# EAGLE design pcb (EAGLE 8.3.2)
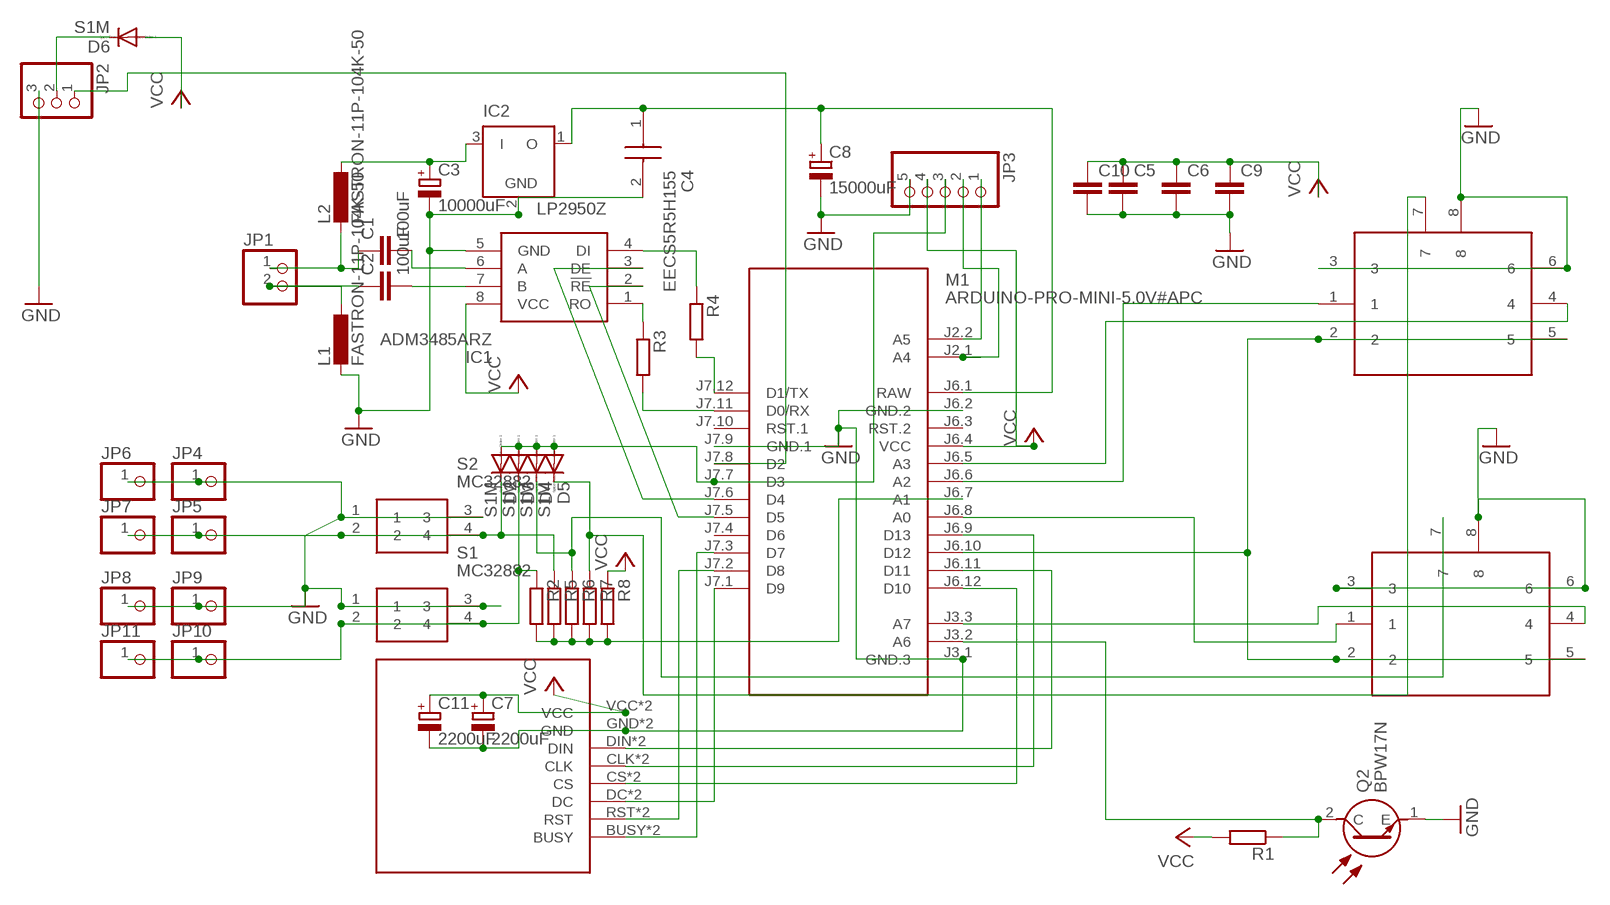
[diagram p0: schematic, sheet 1]

## Parts
C1  100uF  C-EUC1210  [C1210]
C2  100uF  C-EUC1210  [C1210]
C3  10000uF  CPOL-EUE7.5-18  [E7,5-18]
C4  EECS5R5H155  [SG(H)]
C5  C-EUC1812  [C1812]
C6  C-EUC1812  [C1812]
C7  2200uF  CPOL-EUTT5D9  [TT5D9]
C8  15000uF  CPOL-EUE7.5-18  [E7,5-18]
C9  C-EUC1812  [C1812]
C10  C-EUC1812  [C1812]
C11  2200uF  CPOL-EUTT5D9  [TT5D9]
D2  S1M  [SMA]
D3  S1M  [SMA]
D4  S1M  [SMA]
D5  S1M  [SMA]
D6  S1M  [SMA]
IC1  ADM3485ARZ  [SOIC127P600X175-8N]
IC2  LP2950Z  [TO92]
JP1  PINHD-1X2  [1X02]
JP2  PINHD-1X3  [1X03]
JP3  PINHD-1X55X2MM  [1_05X2MM]
JP4  PINHD-1X1  [1X01]
JP5  PINHD-1X1  [1X01]
JP6  PINHD-1X1  [1X01]
JP7  PINHD-1X1  [1X01]
JP8  PINHD-1X1  [1X01]
JP9  PINHD-1X1  [1X01]
JP10  PINHD-1X1  [1X01]
JP11  PINHD-1X1  [1X01]
L1  FASTRON-11P-104K-50  [E5-10,5]
L2  FASTRON-11P-104K-50  [E5-10,5]
M1  ARDUINO-PRO-MINI-5.0V#APC  [ARDUINO-PRO-MINI#APC]
Q2  BPW17N  [BPW17N]
R1  R-EU_R1206  [R1206]
R2  R-EU_R1206  [R1206]
R3  R-EU_R1206  [R1206]
R4  R-EU_R1206  [R1206]
R5  R-EU_R1206  [R1206]
R6  R-EU_R1206  [R1206]
R7  R-EU_R1206  [R1206]
R8  R-EU_R1206  [R1206]
S1  MC32882  [MC32882]
S2  MC32882  [MC32882]
U$1  FJ08K-S  [FJ08K-S]
U$2  FJ08K-S  [FJ08K-S]
U$3  1,54-E-PAPER  [1,54-E-PAPER]

## Nets
A [power]: C1.2 IC1.6(A)
A1 [power]: C1.1 JP1.1 L2.-
B [power]: C2.2 IC1.7(B)
B1 [power]: C2.1 JP1.2 L1.+
GND [power]: C3.- C4.2 C5.2 C6.2 C7.- C8.- C9.2 C10.2 C11.- IC1.5(GND) IC2.2(GND) JP2.3 JP3.5 JP4.1 JP6.1 JP8.1 JP9.1 L1.- M1.J3.1(GND.3) M1.J6.2(GND.2) M1.J7.9(GND.1) Q2.1(E) S1.1 S1.3 S2.1 S2.3 U$1.3 U$1.6 U$1.8 U$2.3 U$2.6 U$2.8 U$3.GND U$3.GND1(GND)
N$1: M1.J6.8(A0) U$2.1
N$2: D2.C JP5.1 JP7.1 R5.1 S2.2 S2.4
N$3: JP3.1 M1.J2.2(A5)
N$4: M1.J7.3(D7) U$3.BUSY U$3.BUSY1(BUSY)
N$5: M1.J7.2(D8) U$3.RST U$3.RST1(RST)
N$6: M1.J7.1(D9) U$3.DC U$3.DC1(DC)
N$7: M1.J6.12(D10) U$3.CS U$3.CS1(CS)
N$8: M1.J6.9(D13) U$3.CLK U$3.CLK1(CLK)
N$9: M1.J6.11(D11) U$3.DIN U$3.DIN1(DIN)
N$11: M1.J6.10(D12) U$1.2 U$1.5 U$2.2 U$2.5
N$12: M1.J3.3(A7) U$2.4
N$13: D5.C R7.1 U$1.7
N$14: M1.J6.6(A2) U$1.1
N$15: M1.J6.5(A3) U$1.4
N$16: D4.C R6.1 U$2.7
N$17: M1.J3.2(A6) Q2.2(C) R1.1
N$19: M1.J7.11(D0/RX) R3.2
N$20 [power]: C3.+ IC2.3(I) L2.+
N$21: IC1.3(DE) M1.J7.6(D4)
N$22: IC1.4(DI) R4.1
N$23: M1.J7.12(D1/TX) R4.2
N$24 [power]: D6.C JP2.2
N$25: IC1.1(RO) R3.1
N$27: JP2.1 M1.J7.8(D2)
N$28: IC1.2(!RE) M1.J7.5(D5)
N$29: M1.J6.7(A1) R2.2 R5.2 R6.2 R7.2 R8.2
N$30: D2.A D3.A D4.A D5.A JP3.3 M1.J7.7(D3)
N$32: JP3.2 M1.J2.1(A4)
N$33: D3.C JP10.1 JP11.1 R2.1 S1.2 S1.4
RAW [power]: C4.1 C8.+ IC2.1(O) M1.J6.1(RAW)
VCC [power]: C5.1 C6.1 C7.+ C9.1 C10.1 C11.+ D6.A IC1.8(VCC) JP3.4 M1.J6.4(VCC) R1.2 R8.1 U$3.VCC U$3.VCC1(VCC)
Unconnected: M1.J6.3(RST.2) M1.J7.4(D6) M1.J7.10(RST.1)

## Library data of the parts
C1 C2 C5 C6 C9 C10 = rcl:C-EU: CAPACITOR, European symbol
C3 C7 C8 C11 = resistor:CPOL-EU: POLARIZED CAPACITOR, European symbol
C4 = SamacSys_Parts1:EECS5R5H155: Panasonic 1.5F 5.5 V dc Through Hole Electric Double Layer Capacitor Source: Datasheet <http://uk.rs-online.com/web/p/products/1094092>; ALLIED_NUMBER: 70067995; ALLIED_PRICE-STOCK: https://www.alliedelec.com/panasonic-eecs5r5h155/70067995/; DESCRIPTION: Panasonic 1.5F 5.5 V dc Through Hole Electric Double Layer Capacitor; HEIGHT: mm; MANUFACTURER_NAME: Panasonic; MANUFACTURER_PART_NUMBER: EECS5R5H155; RS_PART_NUMBER: 9190657; RS_PRICE-STOCK: https://uk.rs-online.com/web/p/products/9190657
D2-D6 = diode:S1M
IC1 = SamacSys_Parts1:ADM3485ARZ: ADM3485ARZ, Line Transceiver, EIA-485, EIA-422, RS-485, RS-422 10Mbit/s Differential, 3.3V, 8-Pin SOIC Source: Datasheet <http://docs-emea.rs-online.com/webdocs/0de0/0900766b80de0e4e.pdf>; DESCRIPTION: ADM3485ARZ, Line Transceiver, EIA-485, EIA-422, RS-485, RS-422 10Mbit/s Differential, 3.3V, 8-Pin SOIC; HEIGHT: 1.75mm; MANUFACTURER_NAME: Analog Devices; MANUFACTURER_PART_NUMBER: ADM3485ARZ; MOUSER_PART_NUMBER: 584-ADM3485ARZ; MOUSER_PRICE-STOCK: https://www.mouser.com/Search/Refine.aspx?Keyword=584-ADM3485ARZ; RS_PART_NUMBER: 6977653P; RS_PRICE-STOCK: http://uk.rs-online.com/web/p/products/6977653P
IC2 = linear:LP2950: 100 mA, Low Power Low Dropout Voltage Regulator Source: http://www.onsemi.com/pub/Collateral/LP2950-D.PDF
JP1 = pinhead:PINHD-1X2: PIN HEADER
JP2 = pinhead:PINHD-1X3: PIN HEADER
JP3 = pinhead:PINHD-1X5: PIN HEADER
JP4-JP11 = pinhead:PINHD-1X1: PIN HEADER
L1 L2 = eigene:FASTRON-11P-104K-50
M1 = diy-modules:ARDUINO-PRO-MINI-*#APC: Arduino Pro Mini (and compatible devices) with angle programming connector More details available here: https://www.arduino.cc/en/Main/ArduinoBoardProMini Click here to find device on ebay.com <http://www.ebay.com/sch/arduino+pro+mini>
Q2 = SamacSys_Parts:BPW17N: BPW17N Vishay, 24 IR + Visible Light Phototransistor, Through Hole 2-Pin 1.8/2.4mm package Source: Datasheet <https://www.vishay.com/docs/81516/bpw17n.pdf>; ARROW_PART_NUMBER: BPW17N; ARROW_PRICE-STOCK: https://www.arrow.com/en/products/bpw17n/vishay?region=nac; DESCRIPTION: BPW17N Vishay, 24 IR + Visible Light Phototransistor, Through Hole 2-Pin 1.8/2.4mm package; HEIGHT: 3.7mm; MANUFACTURER_NAME: Vishay; MANUFACTURER_PART_NUMBER: BPW17N; MOUSER_PART_NUMBER: 782-BPW17N; MOUSER_PRICE-STOCK: https://www.mouser.co.uk/ProductDetail/Vishay-Semiconductors/BPW17N?qs=%2Fjqivxn91ceSHvFjVSmzCw%3D%3D
R1-R8 = resistor:R-EU_: RESISTOR, European symbol
S1 S2 = SamacSys_Parts:MC32882: SWITCH, TACTILE, 50MA, 12VDC, SMD Source: Datasheet <http://www.newark.com/pdfs/datasheets/spc/Ta-1143.pdf>; DESCRIPTION: SWITCH, TACTILE, 50MA, 12VDC, SMD; HEIGHT: mm; MANUFACTURER_NAME: MULTICOMP; MANUFACTURER_PART_NUMBER: MC32882
U$1 U$2 = fj:FJ08K-S
U$3 = 1,54-e-paper:1,54-E-PAPER: e-Paper Display 1,54 mit Kabel

## Net classes
1 power: width 0.61 mm, clearance 0.61 mm to class 0

## Board
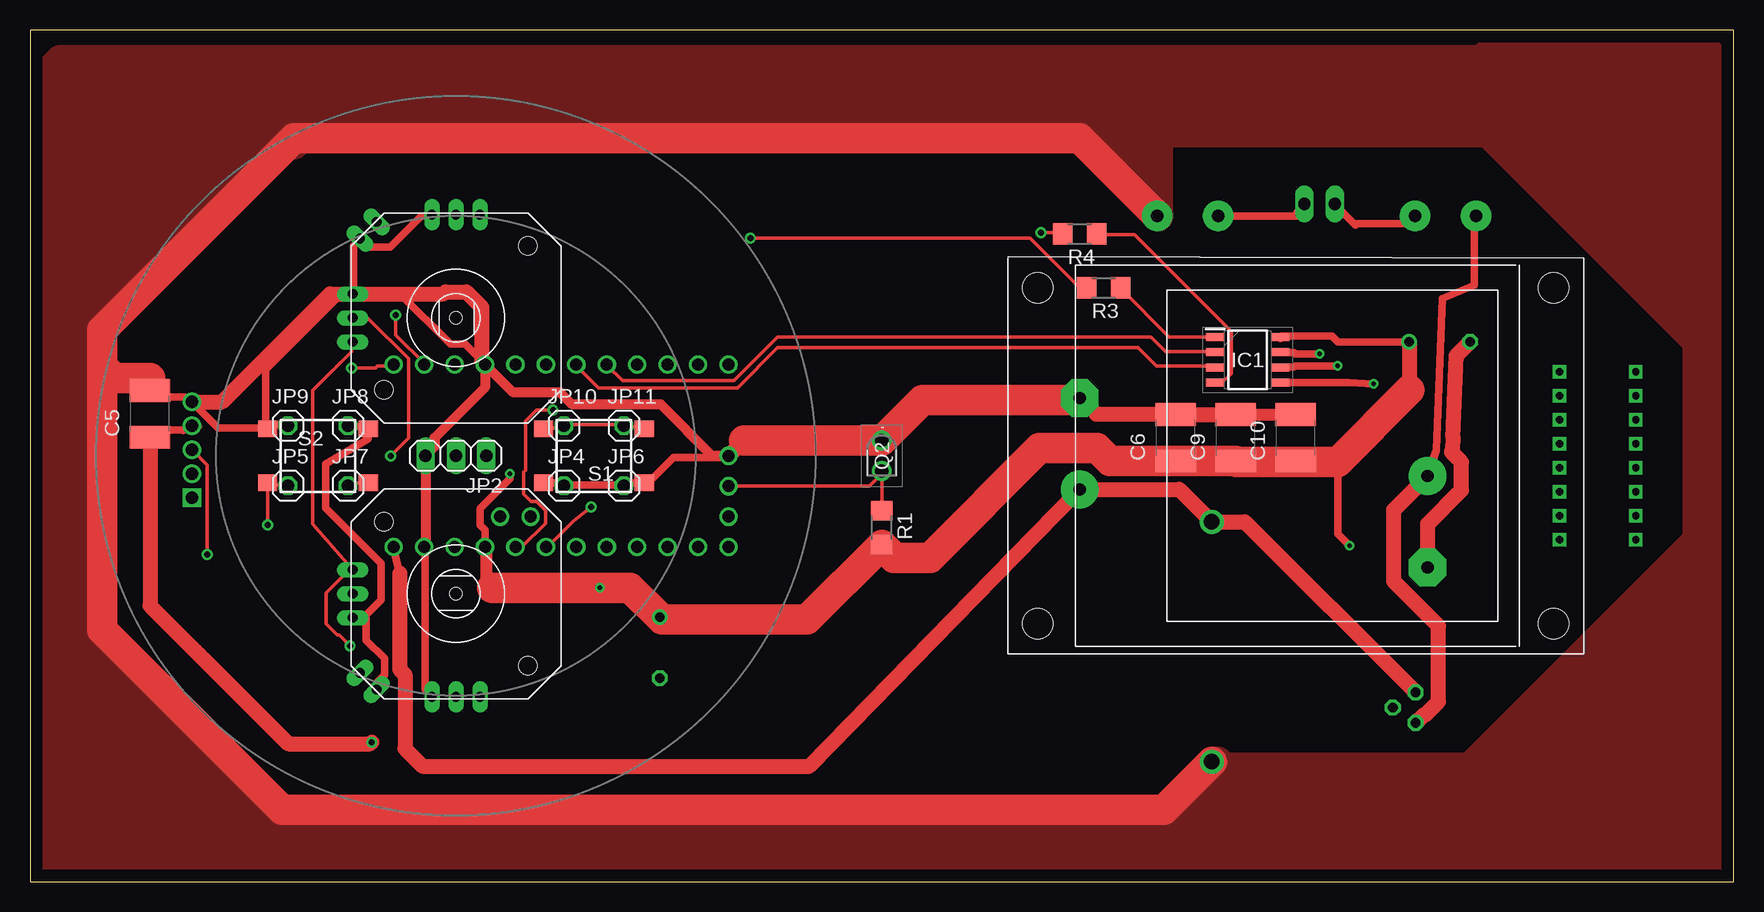
[diagram p1: board, top side]
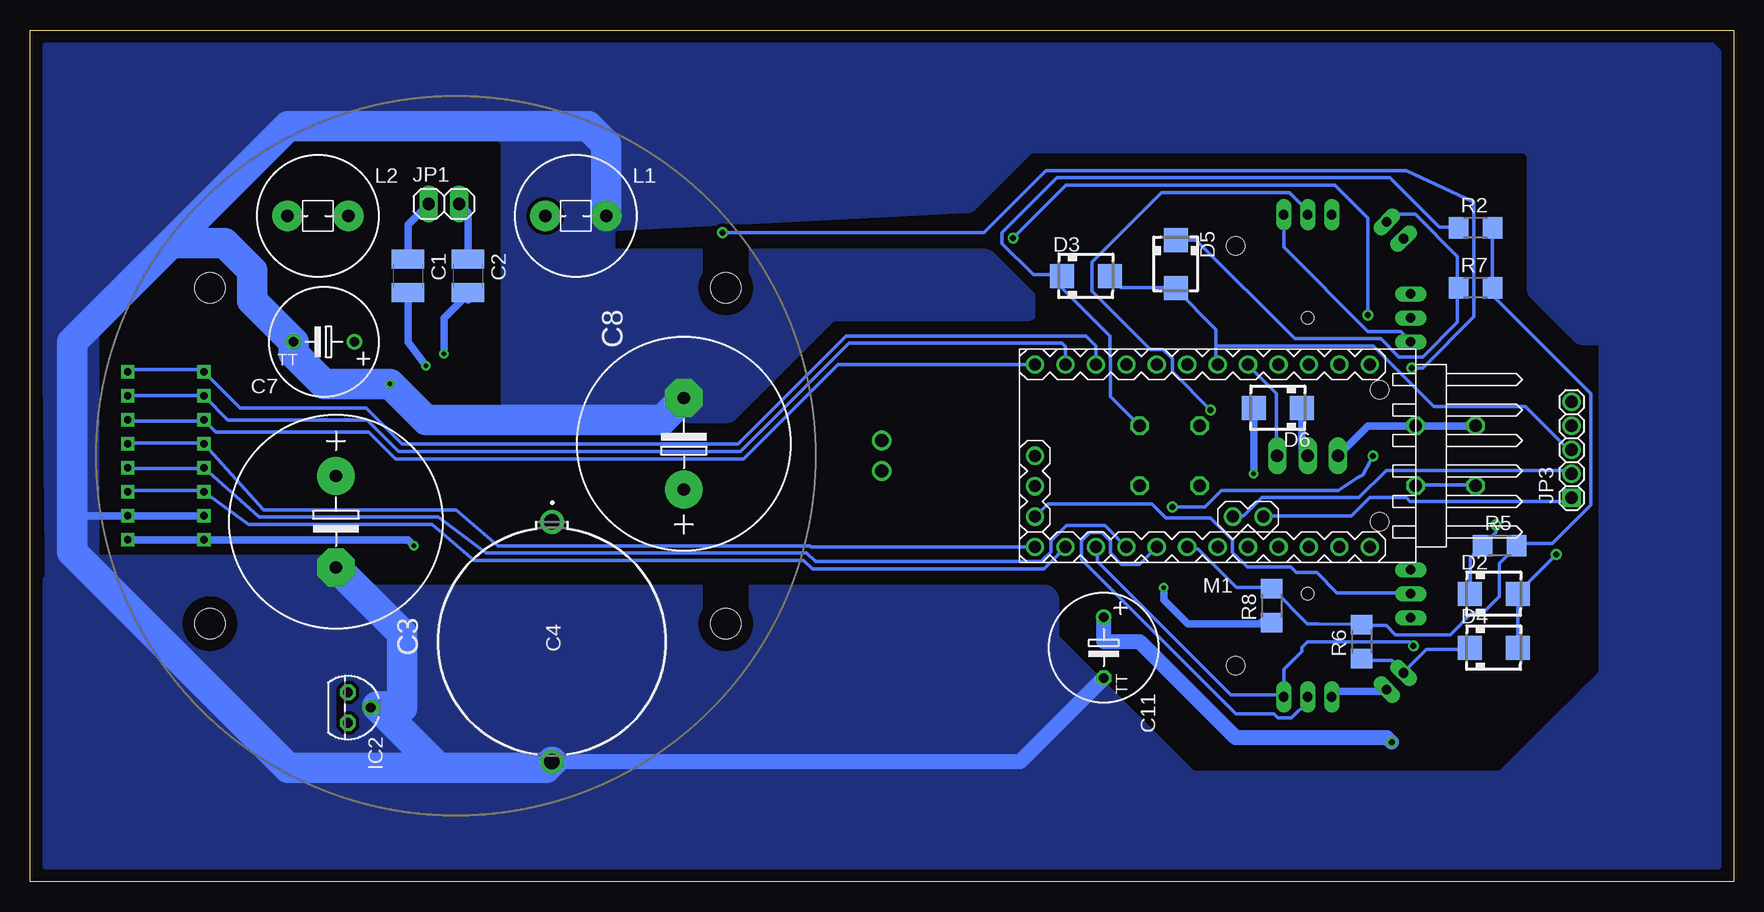
[diagram p2: board, bottom side, seen from below]

Size 142 x 71 mm. Coordinates in mm from the lower left corner, seen from the top.
Outline: 0,0 142,0 142,71 0,71 0,0
Copper layers (1*16): Top 0.035mm / dielectric 1.5mm / Bottom 0.035mm
Design rules "default *": minimum track width 12mil, minimum drill 0.5mm, track to track 12mil, track to pad 12mil, pad to pad 12mil, via to via 12mil, smd to smd 12mil, copper to edge 40mil, drill to drill 6mil, minimum pad ring 10mil, minimum via ring 8mil, stop-mask expansion 4mil, vias tented up to drill 0mil, thermal gap 10mil
Holes 1 mm at 35.5,47 35.5,24

### Footprints (pad centres in the part's own frame; a part is rotated, then mirrored left to right if it is on the bottom)
C1210 = smd 1.6 x 2.7: 1 -1.4,0; 2 1.4,0
E7,5-18 = drill 1.016 pad 3.15: + -3.81,0 | drill 1.016 pad 3.15 octagon: - 3.81,0
SG(H) = drill 1.33 pad 2: 1 -10,0; 2 10,0
C1812 = smd 1.9 x 3.4: 1 -1.95,0; 2 1.95,0
TT5D9 = drill 0.813: + -2.54,0 | drill 0.813 octagon: - 2.54,0
SMA = smd 2 x 2: A 2,0; C -2,0
SOIC127P600X175-8N = smd 1.525 x 0.65: 1 -2.712,1.905; 2 -2.712,0.635; 3 -2.712,-0.635; 4 -2.712,-1.905; 5 2.712,-1.905; 6 2.712,-0.635; 7 2.712,0.635; 8 2.712,1.905
TO92 = drill 0.813 octagon: 1 -1.27,0; 2 0,1.905; 3 1.27,0
1X02 = drill 1.016 long: 1 -1.27,0; 2 1.27,0
1X03 = drill 1.016 long: 1 -2.54,0; 2 0,0; 3 2.54,0
1_05X2MM = drill 1.016 pad 1.3 square: 1 -4,0 | drill 1.016 pad 1.3: 2 -2,0; 3 0,0; 4 2,0; 5 4,0
1X01 = drill 1.016 octagon: 1 0,0
E5-10,5 = drill 1.016 pad 2.54: + -2.54,0; - 2.54,0
ARDUINO-PRO-MINI#APC = drill 1: J2.1 -1.27,5.08; J2.2 -3.81,5.08; J3.1 15.24,0; J3.2 15.24,2.54; J3.3 15.24,5.08; J6.1 -12.7,7.62; J6.2 -10.16,7.62; J6.3 -7.62,7.62; J6.4 -5.08,7.62; J6.5 -2.54,7.62; J6.6 0,7.62; J6.7 2.54,7.62; J6.8 5.08,7.62; J6.9 7.62,7.62; J6.10 10.16,7.62; J6.11 12.7,7.62; J6.12 15.24,7.62; J7.1 15.24,-7.62; J7.2 12.7,-7.62; J7.3 10.16,-7.62; J7.4 7.62,-7.62; J7.5 5.08,-7.62; J7.6 2.54,-7.62; J7.7 0,-7.62; J7.8 -2.54,-7.62; J7.9 -5.08,-7.62; J7.10 -7.62,-7.62; J7.11 -10.16,-7.62; J7.12 -12.7,-7.62
BPW17N = drill 1.09 pad 1.635: 1 -1.27,0; 2 1.27,0
R1206 = smd 1.6 x 1.803: 1 -1.422,0; 2 1.422,0
MC32882 = smd 1.6 x 1.4: 1 -4.2,2.25; 2 -4.2,-2.25; 3 4.2,2.25; 4 4.2,-2.25
FJ08K-S = drill 0.8 long: 1 0,8.6; 2 -2,8.6; 3 2,8.6; 4 8.6,0; 5 8.6,-2; 6 8.6,2; 7 8,6.6; 8 6.6,8 | hole 1.5: -6,6; 6,-6
1,54-E-PAPER = drill 0.6 square: BUSY 22,7; BUSY1 28.35,7; CLK 22,-1; CLK1 28.35,-1; CS 22,1; CS1 28.35,1; DC 22,3; DC1 28.35,3; DIN 22,-3; DIN1 28.35,-3; GND 22,-5; GND1 28.35,-5; RST 22,5; RST1 28.35,5; VCC 22,-7; VCC1 28.35,-7 | hole 2.5: -21.5,-14; -21.5,14; 21.5,14; 21.5,-14

### Placement (x,y rotation side)
C1  110.5,50.5 270 bottom
C2  105.5,50.5 270 bottom
C3  116.5,30 270 bottom
C4  98.5,20 270 bottom
C5  10,39 90 top
C6  95.5,37 90 top
C7  117.5,45 180 bottom
C8  87.5,36.5 90 bottom
C9  100.5,37 90 top
C10  105.5,37 90 top
C11  52.5,19.5 270 bottom
D2  20,24 0 bottom
D3  54,50.5 0 bottom
D4  20,19.5 0 bottom
D5  46.5,51.5 270 bottom
D6  38,39.5 180 bottom
IC1  101.5,43.5 0 top
IC2  115.5,14.5 270 bottom
JP1  107.5,56.5 0 bottom
JP2  35.5,35.5 180 top
JP3  13.5,36 90 bottom
JP4  44.5,33 0 top
JP5  21.5,33 0 top
JP6  49.5,33 0 top
JP7  26.5,33 0 top
JP8  26.5,38 0 top
JP9  21.5,38 0 top
JP10  44.5,38 0 top
JP11  49.5,38 0 top
L1  96.5,55.5 0 bottom
L2  118,55.5 0 bottom
M1  43,35.5 180 bottom
Q2  71,35.5 270 top
R1  71,29.5 270 top
R2  21.5,54.5 0 bottom
R3  89.5,49.5 180 top
R4  87.5,54 180 top
R5  19.5,28 0 bottom
R6  31,20 90 bottom
R7  21.5,49.5 0 bottom
R8  38.5,23 90 bottom
S1  47,35.5 180 top
S2  24,35.5 0 top
U$1  35.5,47 90 top
U$2  35.5,24 180 top
U$3  105.5,35.49 0 top

### Tracks (layer width: path | path; a pad name or v marks a point on that pad's centre or on a via)
A  (via drill 0.35)
  Top 0.305: IC1.6 104.24,42.98
  Top 0.61: v109,43 105.46,43 105.35,42.9 104.24,42.9 IC1.6
  Bottom 0.61: v109,43 110.5,45 C1.2
A1
  Top 0.61: JP1.1 108.81,56.39 110.49,54.71 110.64,54.86 114.76,54.86 115.37,55.47 L2.-
  Bottom 0.61: 110.49,51.97 C1.1 110.5,54.77 JP1.1
B  (via drill 0.35)
  Top 0.61: 104.24,44.2 IC1.7 104.24,44.1 105.35,44.1 105.46,44 v107.5,44
  Bottom 0.61: 105.61,49.07 C2.2 105.5,49 | 105.5,49 105.5,48.5 | 105.5,49 107.5,47 v107.5,44
B1
  Top 0.61: JP1.2 106.22,56.39 105.61,55.78 105.61,55.47 99.06,55.47 L1.+
  Bottom 0.61: 105.61,51.97 C2.1 105.5,55.77 JP1.2
GND  (via drill 0.35)
  Top 0.61: 94.03,55.47 L1.- | C7.- 120.09,44.96 | 42.82,33.22 S1.3 43.13,33.22 44.2,33.22 44.35,33.07 JP4.1 44.65,33.07 49.23,33.07 JP6.1 49.53,33.07 49.68,33.22 50.75,33.22 S1.1 | 51.05,33.22 S1.1 | M1.J3.1 58.22,35.36 53.65,35.36 51.51,33.22 S1.1 | S2.1 19.66,37.8 15.7,37.8 13.56,39.93 JP3.5 13.26,40.08 12.95,40.39 10.06,40.39 C5.2 | U$1.3 26.98,49.07 26.98,53.03 27.43,53.49 U$1.8 27.74,53.49 28.35,52.88 30.02,52.88 32.61,55.47 33.38,55.47 U$1.6 | S2.1 19.66,38.1 19.66,42.67 25.91,48.92 26.67,48.92 U$1.3 | U$2.8 28.96,16 28.96,16.61 29.57,17.22 29.57,18.59 28.04,20.12 28.04,21.95 U$2.6 26.98,22.1 27.89,22.1 29.26,23.47 29.26,26.52 24.65,31.13 24.65,34.83 28.19,36.88 28.19,37.64 S2.3 28.04,37.95 26.52,37.95 JP8.1 | U$2.3 33.38,15.54 32.92,16 32.92,27.58 M1.J6.2 33.07,28.04 | U$1.3 27.28,49.07 30.79,49.07 35.05,44.81 36.27,44.81 37.8,43.28 M1.J7.9 | 33.07,35.36 JP2.3 33.07,35.66 | 37.95,42.82 M1.J7.9 | 38.25,42.82 M1.J7.9 | JP9.1 21.49,38.1 19.96,38.1 S2.1 | C8.- 87.66,40.16 88.86,38.95 | IC1.5 109.91,41.59 v112,41.5
  Top 0.813: 37.8,43.28 38.04,43.04 40.29,40.79 44.2,40.79 45.2,39.78 52.59,39.78 56.87,35.5 M1.J3.1 | M1.J7.9 37.92,41.2 33.72,37 33.72,36.26 JP2.3 32.96,28 M1.J6.2
  Top 1.016: C9.2 C10.2
  Top 1.27: C9.2 C6.2 88.86,38.95 | JP3.5 16,40 25,49 U$1.3 26.98,49.07 | U$1.3 34.46,49 34.61,49.15 36.39,49.15 37.65,47.89 37.65,43.43 38.04,43.04 | C3.- 116.5,29.82 119.32,32.64 119.32,34.98 118.49,35.8 118.58,36.07 118.62,36.99 118.89,43.85 C7.- | 59.51,36.77 M1.J3.1
  Top 2.54: 59.51,36.77 Q2.1 74.39,40.16 87.66,40.16 | C4.2 94.5,6 21,6 6,21 6,43 | 6,43 7,42 10,42 | L1.- 87.46,62 22,62 6,46 6,43
  Bottom 0.61: 113.49,14.61 113.69,14.63 IC2.2 113.39,14.33 | 116.43,26.06 C3.- | C4.2 98.6,10.06 | U$2.8 28.96,15.85 33.07,15.85 33.38,15.54 U$2.3 | JP9.1 JP8.1 30.46,38 JP2.3 | 120.04,44.54 C7.- | C8.- 87.71,40.1 | 138.5,30.5 U$3.GND1 U$3.GND
  Bottom 1.27: 109.09,10 C4.2 59.46,10 C11.-
  Bottom 2.54: C8.- 89.31,38.5 109,38.5 v112,41.5 117.5,41.5 120.04,44.04 C7.- 123.46,48.42 123.46,50.96 125.76,53.25 130.25,53.25 | C4.2 99,9.5 108,9.5 | 108,9.5 120.5,9.5 138.5,27.5 138.5,30.5 138.5,45 130.25,53.25 | 130.25,53.25 120.5,63 95.5,63 93.96,61.46 L1.- | 108,9.5 108,9.53 113.07,14.61 111.11,14.61 111,14.5 111,20.69 C3.-
  pour Top: 99,10 99,0.5 0.5,0.5 0.5,29 6,23.5 6,20.5 20.5,6 94.5,6 98.5,10
  pour Top: 98.5,10 99,9.5 120,9.5 139,28.5 139,45 121.5,62.5 121.5,63.5 121.5,69 140,69 140,1.5 139.5,2 99,2 98.5,2.5
  pour Top: 94,55.5 94,68.5 2.5,68.5 2,68 2,27 2.5,26.5 4.5,26.5 5.5,27.5 5.5,45.5 21.5,61.5 22,61.5 22.5,62 87.5,62
  pour Top: 94,55.5 94,62.5 122,62.5 122,69 121.5,68.5 85.5,68.5 88.5,65.5 88.5,61
  pour Bottom: 87.5,40 87,39.5 84,39.5 77.5,46 75.5,48 59,48 62.5,51.5 63,51.5 94.5,51.5 94.5,56 94,56 94.5,61.5 96,63 102.5,63 101.5,62 101.5,39 100.5,40
  pour Bottom: 136.5,25.5 116.5,25.5 114.5,23.5 57.5,23.5 57.5,20 45.5,8 19,8 10,17 10,50 8.5,51.5 2,51.5 2,2 2.5,1.5 139.5,1.5 140,2 140,24.5 138.5,26 116.5,26
  pour Bottom: 64,57 59,62 25.5,62 17,62 16,61 16,49.5 12.5,46 2.5,46 2,46.5 2,68.5 2.5,69 140,69 139.5,23.5 137.5,25.5 137.5,46.5 120.5,63.5 94.5,63.5 94,63 94,55.5 93.5,55.5
N$1
  Bottom 0.305: M1.J6.8 49.51,26.45 51.02,26.45 51.95,27.38 51.95,28.38 52.66,29.09 53.66,29.09 54.37,28.38 54.37,26.87 41.5,14 38.33,14 37.96,13.63 36.87,13.63 35.5,15 U$2.1
N$2  (via drill 0.5)
  Top 0.305: v19.81,29.72 19.81,33.07 | 19.81,33.07 19.81,33.22 S2.2 19.81,33.07 | 19.81,33.07 21.49,33.07 JP5.1 | S2.4 28.19,33.22 26.67,33.22 26.52,33.07 JP7.1
  Bottom 0.305: v19.81,29.72 19.81,29.11 20.88,28.04 R5.1 21.03,27.89 21.95,26.98 21.95,24.08 D2.C | JP5.1 21.64,33.07 26.36,33.07 JP7.1
N$3
  Bottom 0.305: M1.J2.2 39.17,30.48 31.85,30.48 30.33,32 27.28,32 26.98,31.7 13.72,31.7 13.56,31.85 JP3.1
N$4
  Top 0.305: 127.41,42.52 U$3.BUSY
  Bottom 0.305: U$3.BUSY1 133.81,42.67 127.71,42.67 U$3.BUSY 124.48,39.47 114,39.47 111,36.47 88.47,36.47 88.44,36.5 83,36.5 74,45.5 54,45.5 53.16,44.66 M1.J7.3
N$5
  Bottom 0.305: U$3.RST 127.71,40.54 133.81,40.54 U$3.RST1 | 55.78,43.13 M1.J7.2 55.7,44.59 56,44.89 73.75,44.89 82.78,35.86 111.25,35.86 113.89,38.5 125.51,38.5 U$3.RST | 127.42,40.41 U$3.RST
N$6
  Bottom 0.305: U$3.DC1 133.81,38.41 127.71,38.41 U$3.DC 126.51,37.5 113.76,37.5 111.5,35.25 82.53,35.25 74.66,43.12 M1.J7.1 | M1.J7.1 58.37,42.98 | 58.52,42.98 M1.J7.1
N$7
  Bottom 0.305: U$3.CS1 133.81,36.58 127.71,36.58 U$3.CS 122.51,31 106.5,31 103,28 77,28 76.88,27.88 M1.J6.12
N$8
  Bottom 0.305: U$3.CLK1 133.81,34.44 127.71,34.44 U$3.CLK 122.9,30.39 108,30.39 104,27.39 77.25,27.39 76.53,26.67 57.74,26.67 56.91,27.5 56.91,28.38 55.59,29.7 52.41,29.7 51.34,28.63 51.34,28.6 M1.J6.9
N$9
  Bottom 0.305: U$3.DIN1 133.81,32.61 127.71,32.61 U$3.DIN 123.79,29.78 108.5,29.78 105,26.78 77.5,26.78 76.78,26.06 57.49,26.06 56.3,27.24 56.3,27.28 M1.J6.11
N$11  (via drill 0.5)
  Top 0.305: v26.67,19.66 25.76,20.57 25.6,20.57 24.69,21.49 24.69,24.08 26.67,26.06 U$2.5 26.67,26.21 23.58,29.8 23.58,40.95 26.82,44.2 26.82,44.96 U$1.2
  Bottom 0.305: M1.J6.10 53.03,27.74 53.03,26.67 41.91,15.54 37.64,15.54 U$2.2 37.49,15.54 37.49,17.68 35.97,19.2 35.97,19.51 35.51,19.96 26.98,19.96 v26.67,19.66 | U$1.5 37.49,55.47 37.49,52.88 30.48,45.87 27.74,45.87 26.98,45.11 U$1.2
N$12
  Bottom 0.305: U$2.4 26.98,24.08 33.07,24.08 34.75,25.76 36.42,25.76 36.88,26.21 40.54,26.21 41.76,27.43 41.76,28.5 43.59,30.33 47.33,30.33 48.5,31.5 57.16,31.5 M1.J3.3 58.22,30.33
N$13
  Bottom 0.305: U$1.7 28.8,55.02 28.19,55.63 26.52,55.63 23.01,52.12 23.01,49.53 R7.1 23.01,49.38 23.01,46.63 25.91,43.74 27.89,43.74 29.41,45.26 36.58,45.26 44.81,53.49 46.48,53.49 D5.C
N$14  (via drill 0.5)
  Top 0.305: v46.76,31.24 45.26,30.02 43.13,27.89 M1.J6.6 | U$1.1 26.98,46.94 28.19,46.94 31.55,43.59 31.55,36.99 v30.05,35.49
  Bottom 0.305: v30.05,35.49 30.55,34.53 30.89,33.88 31.39,33.64 32.92,32.61 42.67,32.61 44.04,31.24 v46.76,31.24
N$15  (via drill 0.5)
  Top 0.305: v43.59,39.32 42.22,39.32 41.3,38.41 41.3,34.29 41.15,34.14 41.15,32.31 41.76,31.7 42.22,31.7 42.98,30.94 42.98,29.87 41,27.89 40.54,27.89 M1.J6.5
  Bottom 0.305: v43.59,39.32 46.79,42.52 46.79,43.59 47.55,44.35 48.62,44.35 53.49,49.23 53.49,51.66 47.7,57.45 37.03,57.45 35.51,55.93 35.51,55.63 U$1.4
N$16
  Bottom 0.305: D4.C 22.1,19.36 25.6,19.36 27.43,17.53 U$2.7 27.58,17.53 28.5,18.44 30.94,18.44 R6.1
N$17
  Top 0.305: 71,34 Q2.2 | 71,34 R1.1 | M1.J3.2 69.96,32.96 71,34
N$19  (via drill 0.5)
  Top 0.305: v60.05,53.65 83.36,53.65 87.48,49.53 87.94,49.53 R3.2 | v30.48,47.24 30.48,45.57 32.92,43.13 M1.J7.11
  Bottom 0.305: v60.05,53.65 55.63,58.06 33.22,58.06 30.48,55.32 v30.48,47.24
N$20
  Top 0.61: L2.+ 120.4,55.47 120.4,49.74 117.74,48.59 117.24,35.98 C3.+
  Top 1.27: IC2.3 116.14,13.87 116.29,13.87 117.41,14.98 117.41,21.3 113.68,25.02 113.68,30.99 C3.+
N$21
  Top 0.305: IC1.3 98.75,42.98 93.88,42.98 92.35,44.5 62.33,44.5 58.98,41.15 47.4,41.15 45.57,42.98 M1.J7.6
N$22
  Top 0.305: IC1.4 98.91,41.6 99.36,41.6 100.13,42.37 100.13,45.87 92.05,53.95 89,53.95 R4.1
N$23  (via drill 0.5)
  Top 0.305: v84.28,54.1 85.95,54.1 R4.2 | v26.82,42.82 28.8,42.82 28.96,42.98 30.18,42.98 M1.J7.12
  Bottom 0.305: v84.28,54.1 62.48,54.1 57.3,59.28 27.28,59.28 21.64,56.65 21.64,47.09 25.91,42.82 v26.82,42.82
N$24
  Bottom 0.61: JP2.2 35.97,35.97 35.97,39.47 D6.C
N$25
  Top 0.305: IC1.1 98.75,45.41 94.94,45.41 90.98,49.38 R3.1
N$27
  Bottom 0.305: M1.J7.8 40.39,42.98 38.1,40.69 38.1,35.51 JP2.1
N$28
  Top 0.305: IC1.2 98.75,44.2 94.64,44.2 93.42,45.41 62.33,45.41 58.67,41.76 49.38,41.76 48.16,42.98 M1.J7.5
N$29
  Bottom 0.305: 44.96,27.74 45.41,27.74 M1.J6.7 44.96,27.74 | 44.96,27.74 44.65,27.74 41.45,24.54 38.56,24.54 R8.2 38.41,24.38 35.51,21.49 34.59,21.49 R6.2 30.94,21.34 28.96,21.34 28.19,20.57 23.62,20.57 21.79,22.4 20.88,22.4 19.51,23.77 19.51,26.52 18.14,27.89 R5.2 17.98,28.04 17.83,28.19 15.09,28.19 11.89,31.39 11.89,40.69 19.96,48.77 19.96,49.38 R7.2 20.12,49.53 20.12,54.41 R2.2
N$30  (via drill 0.5)
  Top 0.305: v14.78,27.28 14.78,34.75 13.56,35.97 JP3.3
  Bottom 0.305: D4.A 17.98,19.51 17.98,23.93 D2.A 17.98,24.08 v14.78,27.28 | D3.A 51.97,50.44 51.05,49.53 46.63,49.53 D5.A 46.48,49.38 43.13,46.02 43.13,44.65 | 43.13,44.65 43.13,43.13 M1.J7.7 | 43.13,44.65 30.02,44.65 24.99,39.62 17.37,39.62 13.87,36.12 13.56,36.12 JP3.3
N$32
  Bottom 0.305: M1.J2.1 41.6,30.48 40.84,30.48 39.32,32 31.24,32 28.96,34.29 13.72,34.29 13.56,34.14 JP3.2
N$33
  Top 0.305: 42.82,37.8 S1.4 42.98,37.8 44.2,37.8 44.35,37.95 JP10.1 44.5,38.1 49.38,38.1 JP11.1 49.53,37.95 51.05,37.95 S1.2 51.05,37.8
  Bottom 0.305: 56.08,50.6 58.37,50.6 60.96,53.19 60.96,54.1 56.39,58.67 28.65,58.67 24.54,54.56 23.01,54.56 R2.1 | 56.08,50.6 D3.C | JP11.1 51.95,40.45 51.95,43.62 52,43.67 52,45.5 56.08,49.58 56.08,50.6
RAW
  Top 0.61: 30.83,25.7 30.33,27.74 M1.J6.1 | 87.63,32.61 C8.+ 87.33,32.46
  Top 1.27: 87.33,32.46 64.97,9.61 32.72,9.61 31.26,11.07 31.26,17.25 30.83,17.68 30.83,25.7 | C8.+ 95.81,32.69 C4.1 101.27,30 IC2.1
VCC  (via drill 0.35, 0.5)
  Top 0.61: 104.24,45.26 IC1.8 104.31,45.5 108.5,45.5 109,45 C7.+ | 37.95,27.74 M1.J6.4 37.92,29.33 37.52,29.73 37.52,31.11 40,33.59 v40,34 | 14.02,37.95 13.56,37.95 JP3.4 12.76,37.6 12.8,37.64 10.06,37.64 C5.1 | 100.55,35 C9.1 | v110,28 109,29 109,35
  Top 1.016: C10.1 105.55,35 109,35 | M1.J6.4 38,27.8 38,24 38.5,24.5 40,24.5
  Top 1.27: C7.+ 114.96,40.96 | C5.1 10,23 21.5,11.5 28.39,11.5 v28.5,11.61
  Top 2.54: 114.96,40.96 109,35 100.55,35 | C9.1 C6.1 90.03,35.05 88.93,36.14 84.14,36.14 75,27 72,27 71.5,27.5 71.5,27.58 R1.2 64.78,21.86 52.68,21.86 C11.+ 50.04,24.5 v47.5,24.5 40,24.5 38.5,24.5
  Bottom 0.61: 39.47,39.47 D6.A v40,34 | 39.32,21.64 R8.1 38.58,21.5 45.5,21.5 47.5,23.5 v47.5,24.5 | v110,28 110.5,28.5 126.49,28.5 U$3.VCC U$3.VCC1
  Bottom 1.27: v28.5,11.61 28.89,12 41.5,12 49.5,20 52.5,20 C11.+